# Altium schematic sheet DSO_CPLD.SchDoc
size A4
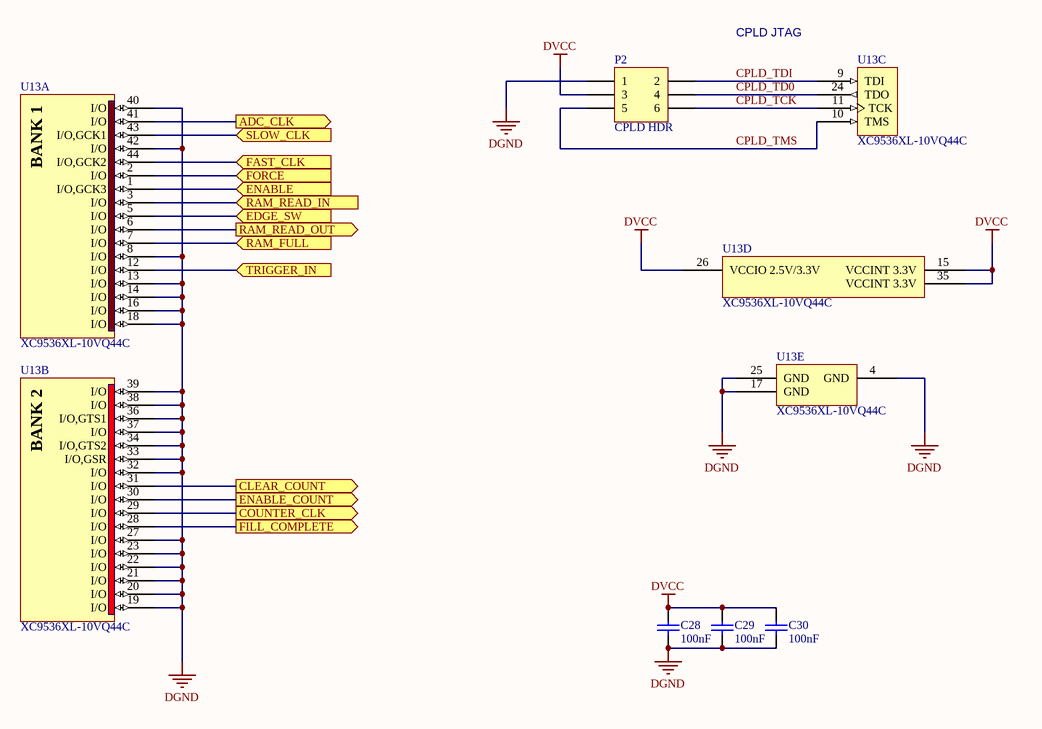
[diagram p0: DSO_CPLD.SchDoc]

## Parts
C28  100nF  [0805C]
C29  100nF  [0805C]
C30  100nF  [0805C]
P2  CPLD HDR  [HDR3x2]
U13  XC9536XL-10VQ44C  [VQ44_L]  (parts A,B,C,D,E of 5)

## Ports
ADC_CLK (out), CLEAR_COUNT (out), COUNTER_CLK (out), EDGE_SW (in), ENABLE (in), ENABLE_COUNT (out), FAST_CLK (in), FILL_COMPLETE (out), FORCE (in), RAM_FULL (in), RAM_READ_IN (in), RAM_READ_OUT (out), SLOW_CLK (in), TRIGGER_IN (in)

## Nets
DGND: C28.2 C29.2 C30.2 P2.1 U13.4(GND) U13.8(I/O) U13.13(I/O) U13.14(I/O) U13.16(I/O) U13.17(GND) U13.18(I/O) U13.19(I/O) U13.20(I/O) U13.21(I/O) U13.22(I/O) U13.23(I/O) U13.25(GND) U13.27(I/O) U13.32(I/O) U13.33(I/O,GSR) U13.34(I/O,GTS2) U13.36(I/O,GTS1) U13.37(I/O) U13.38(I/O) U13.39(I/O) U13.40(I/O) U13.42(I/O)
DVCC: C28.1 C29.1 C30.1 P2.3 U13.15(VCCINT_3.3V) U13.26(VCCIO_2.5V/3.3V) U13.35(VCCINT_3.3V)
ADC_CLK: U13.41(I/O) ; port ADC_CLK
CLEAR_COUNT: U13.31(I/O) ; port CLEAR_COUNT
COUNTER_CLK: U13.29(I/O) ; port COUNTER_CLK
CPLD_TCK: P2.6 U13.11(TCK)
CPLD_TD0: P2.4 U13.24(TDO)
CPLD_TDI: P2.2 U13.9(TDI)
CPLD_TMS: P2.5 U13.10(TMS)
EDGE_SW: U13.5(I/O) ; port EDGE_SW
ENABLE: U13.1(I/O,GCK3) ; port ENABLE
ENABLE_COUNT: U13.30(I/O) ; port ENABLE_COUNT
FAST_CLK: U13.44(I/O,GCK2) ; port FAST_CLK
FILL_COMPLETE: U13.28(I/O) ; port FILL_COMPLETE
FORCE: U13.2(I/O) ; port FORCE
RAM_FULL: U13.7(I/O) ; port RAM_FULL
RAM_READ_IN: U13.3(I/O) ; port RAM_READ_IN
RAM_READ_OUT: U13.6(I/O) ; port RAM_READ_OUT
SLOW_CLK: U13.43(I/O,GCK1) ; port SLOW_CLK
TRIGGER_IN: U13.12(I/O) ; port TRIGGER_IN

## Notes on the sheet
- CPLD JTAG
- (in symbol XC9536XL-10VQG44C, part A) BANK 1
- (in symbol XC9536XL-10VQG44C, part B) BANK 2

## Library data of the parts
C28-C30 = C: Capacitor; Reviewed by: RM - 2018/08/05; Revision: July-2002: Re-released for DXP Platform.; Value: 100nF; Supplier 1: *; Supplier Part Number 1: *
P2 = Header 3x2: Header, 5-Pin; Reviewed by: RM - 2018/08/05; Supplier 1: Digi-Key; Supplier Part Number 1: 952-2121-ND
U13 = XC9536XL-10VQG44C: FastFLASH XC900XL, 3.3V High-Performance 36 Macrocell CPLD, 34 User I/Os, 44-Pin VQFP, Speed Grade 10, Commercial Grade; Reviewed by: RM - 2018/08/05; Supplier 1: Digi-Key; Supplier Part Number 1: 122-1385-ND